# EAGLE design USB_Isolator (EAGLE 9.2.2)
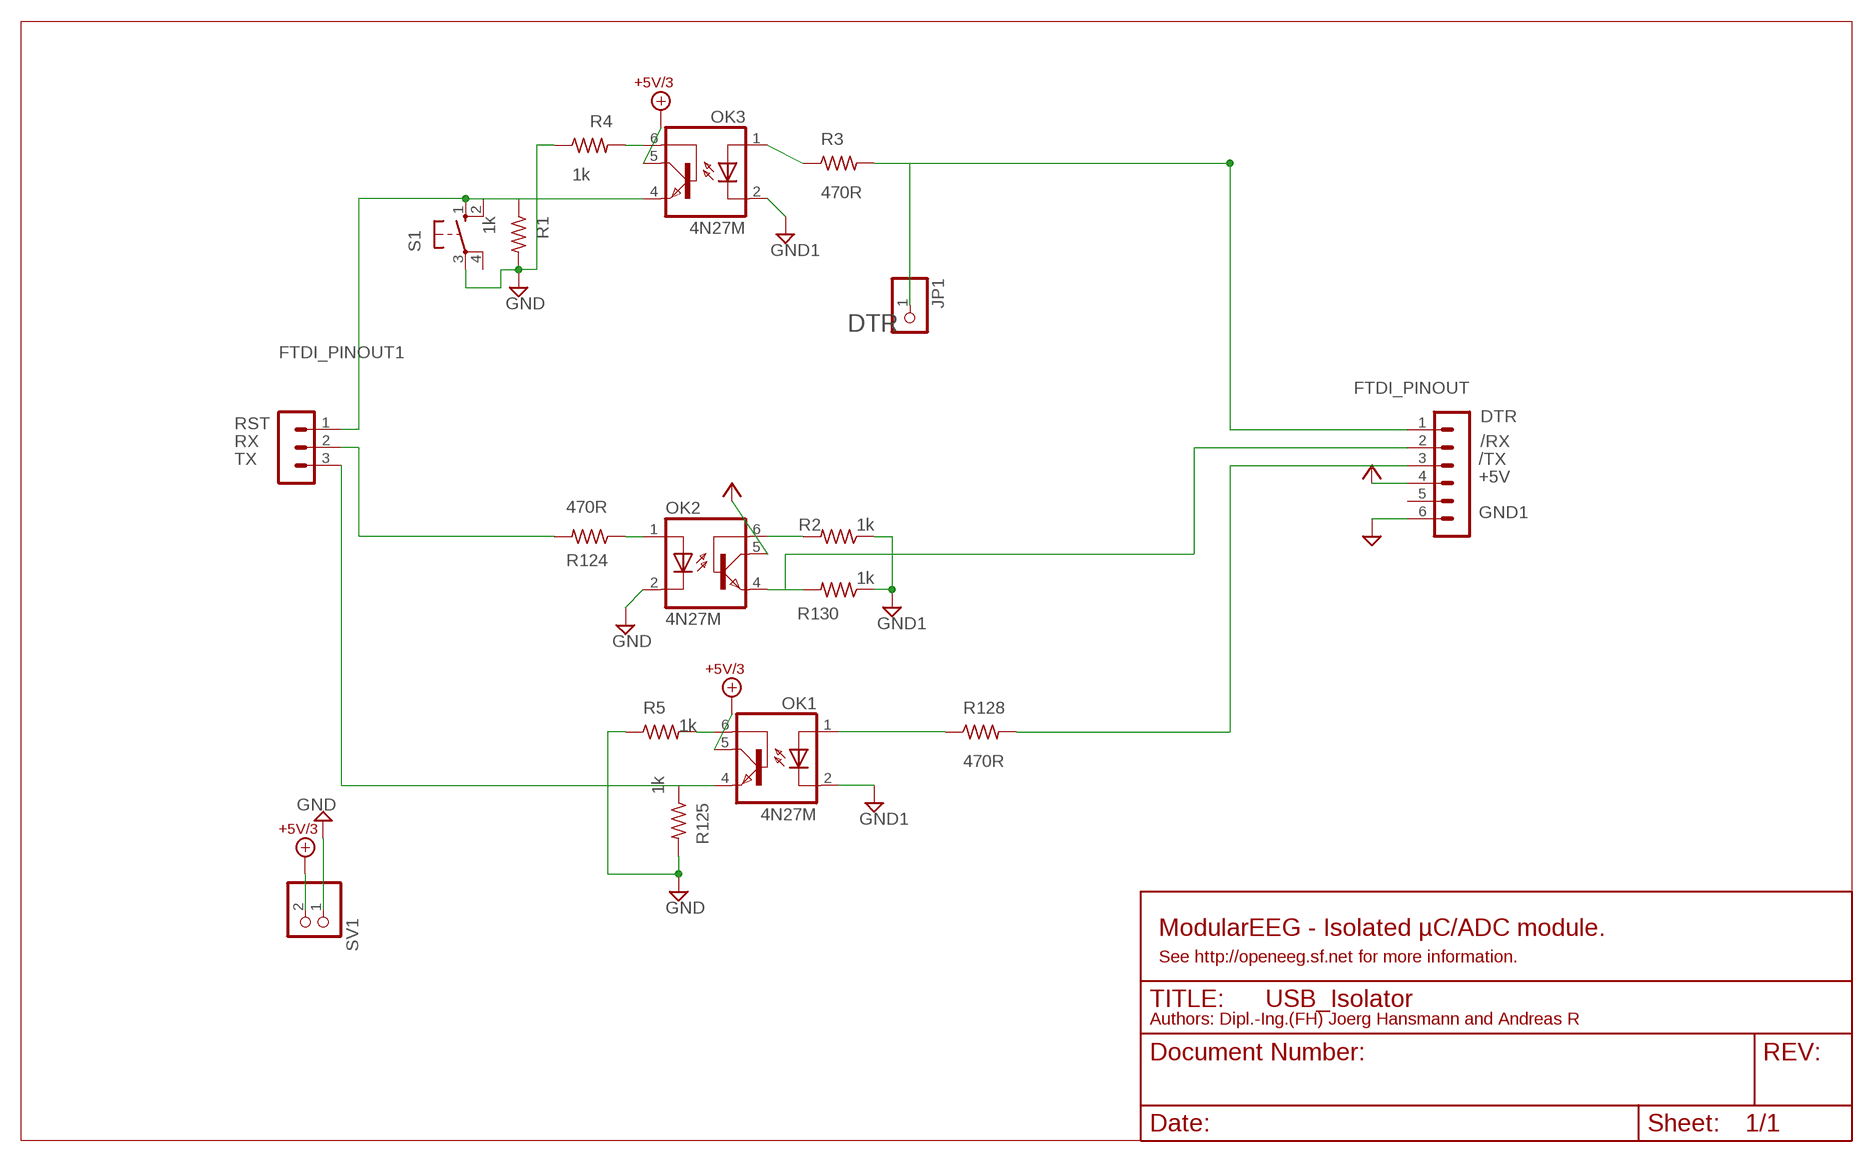
[diagram p0: schematic, sheet 1]

## Parts
FTDI_PINOUT  MA06-1  [MA06-1]
FTDI_PINOUT1  MA03-1  [MA03-1]
JP1  PINHD-1X1  [1X01]
OK1  4N27M  [DIL06]
OK2  4N27M  [DIL06]
OK3  4N27M  [DIL06]
R1  1k  R-US_0204/5  [0204/5]
R2  1k  R-US_0204/7  [0204/7]
R3  470R  R-US_0204/7  [0204/7]
R4  1k  R-US_0204/2V  [0204V]
R5  1k  R-US_0204/5  [0204/5]
R124  470R  R-US_0204/7  [0204/7]
R125  1k  R-US_0204/5  [0204/5]
R128  470R  R-US_0204/7  [0204/7]
R130  1k  R-US_0204/7  [0204/7]
S1  10-XX  [B3F-10XX]
SV1  PINHD-1X2  [1X02]

## Nets
+5V: FTDI_PINOUT.4 OK2.5(COL)
+5V/3: OK1.5(COL) OK3.5(COL) SV1.2
/RX: FTDI_PINOUT.2 OK2.4(EMI) R130.2
/TX: FTDI_PINOUT.3 R128.2
DTR: FTDI_PINOUT.1 JP1.1 R3.2
GND: OK2.2(C) R1.2 R4.1 R5.1 R125.2 S1.3(P) SV1.1
GND1: FTDI_PINOUT.6 OK1.2(C) OK3.2(C) R2.1 R130.1
N$1: OK3.1(A) R3.1
N$2: OK2.6(BAS) R2.2
N$3: OK3.6(BAS) R4.2
N$5: OK1.6(BAS) R5.2
N$8: OK2.1(A) R124.1
N$61: OK1.1(A) R128.1
RST: FTDI_PINOUT1.1 OK3.4(EMI) R1.1 S1.1(S) S1.2(S1)
RX: FTDI_PINOUT1.2 R124.2
TX: FTDI_PINOUT1.3 OK1.4(EMI) R125.1
Unconnected: FTDI_PINOUT.5 S1.4(P1)

## Notes on the sheet
- ModularEEG - Isolated µC/ADC module.
- See http://openeeg.sf.net for more information.
- Authors: Dipl.-Ing.(FH) Joerg Hansmann and Andreas R

## Library data of the parts
FTDI_PINOUT = con-lstb:MA06-1: PIN HEADER; OC_FARNELL: unknown; OC_NEWARK: unknown
FTDI_PINOUT1 = con-lstb:MA03-1: PIN HEADER; OC_FARNELL: unknown; OC_NEWARK: unknown
JP1 = pinhead:PINHD-1X1: PIN HEADER
OK1-OK3 = optocoupler:4N*?M: General Purpose 6-Pin Phototransistor Optocouplers Source: http://www.fairchildsemi.com/ds/4N/4N35-M.pdf; MF: FAIRCHILD SEMICONDUCTOR; MPN: 4N27M; OC_FARNELL: unknown; OC_NEWARK: 72K9939
R1-R5 R124 R125 R128 R130 = resistor:R-US_: RESISTOR, American symbol
S1 = switch-omron:10-XX: OMRON SWITCH; MPN: B3F-1000; OC_FARNELL: 176432; OC_NEWARK: 36M3542
SV1 = pinhead:PINHD-1X2: PIN HEADER

## Board
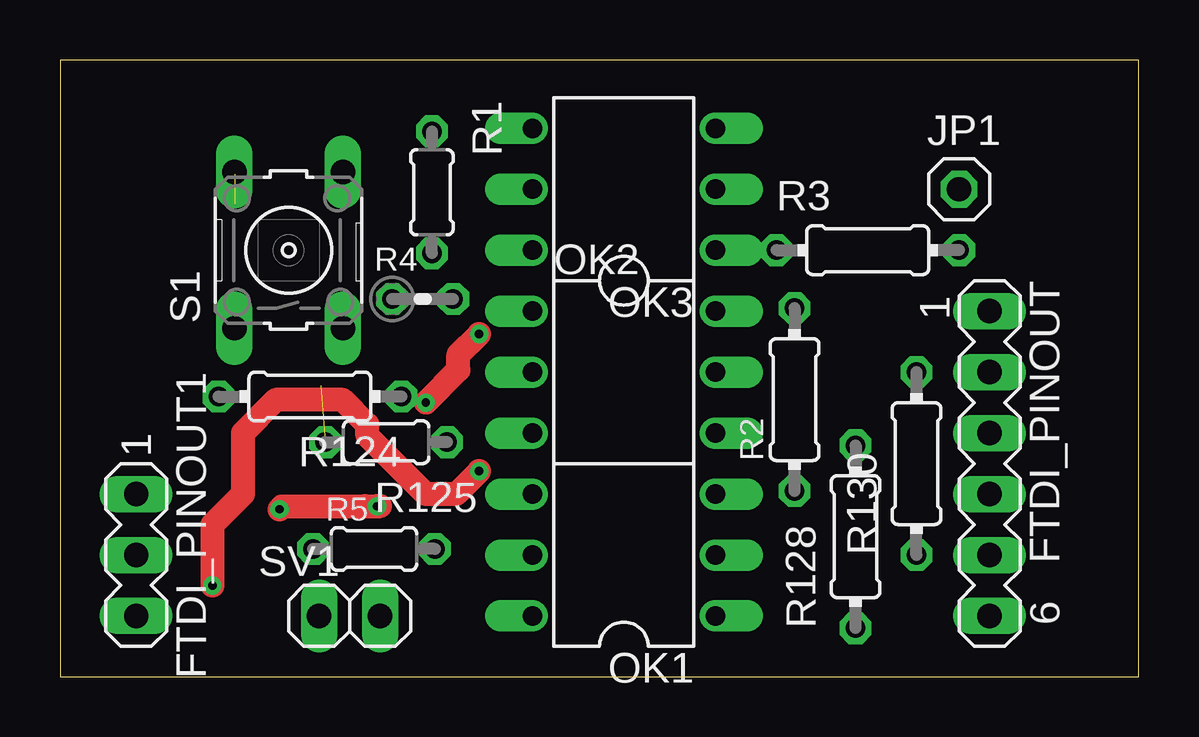
[diagram p1: board, top side]
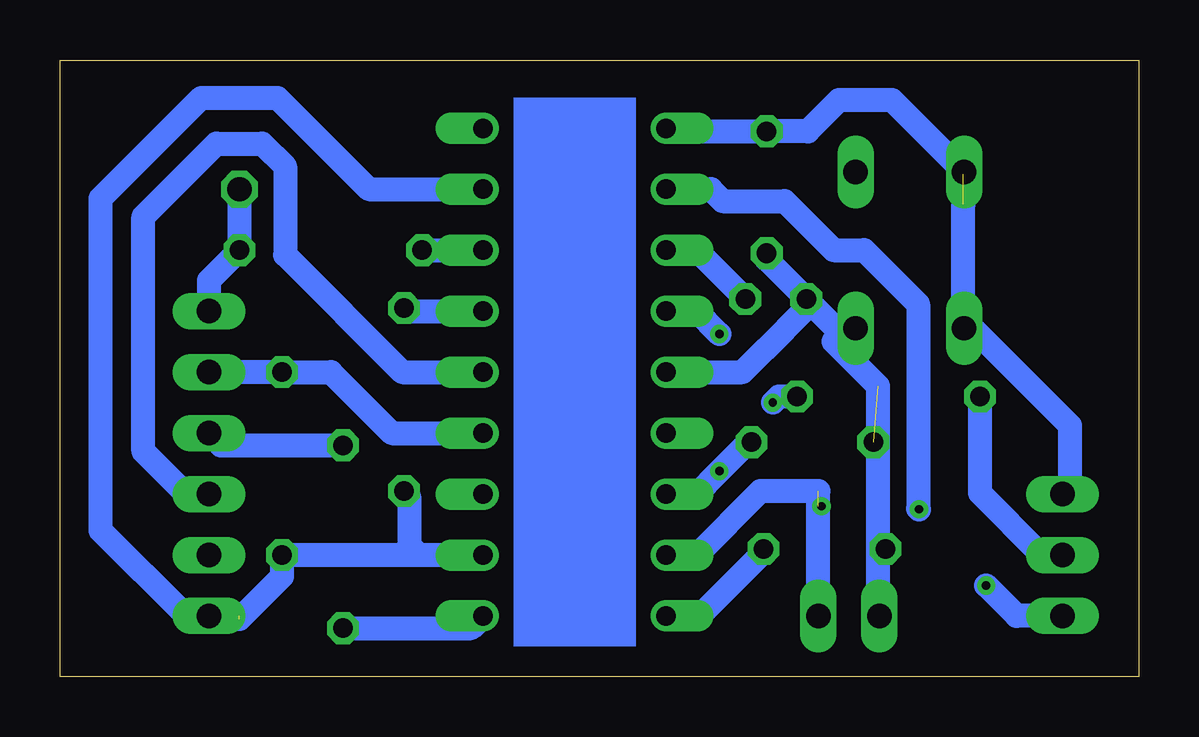
[diagram p2: board, bottom side, seen from below]

Size 44.94 x 25.7 mm. Coordinates in mm from the lower left corner, seen from the top.
Outline: 0,0 44.94,0 44.94,25.7 0,25.7 0,0
Copper layers (1*16): Top 0.035mm / dielectric 1.5mm / Bottom 0.035mm
Design rules "default *": minimum track width 1mm, minimum drill 0.35mm, track to track 0.6mm, track to pad 0.6mm, pad to pad 0.6mm, via to via 0.6mm, smd to smd 6mil, copper to edge 40mil, drill to drill 6mil, minimum pad ring 10mil, minimum via ring 8mil, stop-mask expansion 4mil, vias tented up to drill 0mil, thermal gap 10mil

### Footprints (pad centres in the part's own frame; a part is rotated, then mirrored left to right if it is on the bottom)
MA06-1 = drill 1.016 long: 1 -6.35,0; 2 -3.81,0; 3 -1.27,0; 4 1.27,0; 5 3.81,0; 6 6.35,0
MA03-1 = drill 1.016 long: 1 -2.54,0; 2 0,0; 3 2.54,0
1X01 = drill 1.016 octagon: 1 0,0
DIL06 = drill 0.813 offset: 1 -2.54,-3.81; 2 0,-3.81; 3 2.54,-3.81; 4 2.54,3.81; 5 0,3.81; 6 -2.54,3.81
0204/5 = drill 0.813 octagon: 1 -2.54,0; 2 2.54,0
0204/7 = drill 0.813 octagon: 1 -3.81,0; 2 3.81,0
0204V = drill 0.813 octagon: 1 -1.27,0; 2 1.27,0
B3F-10XX = drill 1.016 long: 1 -3.251,2.261; 2 3.251,2.261; 3 -3.251,-2.261; 4 3.251,-2.261
1X02 = drill 1.016 long: 1 -1.27,0; 2 1.27,0

### Placement (x,y rotation side)
FTDI_PINOUT  38.73,8.89 270 top
FTDI_PINOUT1  3.17,5.08 270 top
JP1  37.47,20.32 0 top
OK1  23.5,5.08 90 top
OK2  23.5,12.7 270 top
OK3  23.5,20.32 90 top
R1  15.49,20.19 270 top
R2  30.61,11.56 90 top
R3  33.66,17.78 0 top
R4  15.11,15.75 0 top
R5  13.08,5.33 0 top
R124  10.41,11.68 180 top
R125  13.59,9.78 180 top
R128  33.15,5.84 90 top
R130  35.69,8.89 90 top
S1  9.53,17.78 90 top
SV1  12.06,2.54 0 top

### Tracks (layer width: path | path; a pad name or v marks a point on that pad's centre or on a via)
+5V
  Bottom 1: OK2.5 30.67,12.7 35.56,17.59 35.56,21.27 36.51,22.23 38.42,22.23 41.47,19.18 41.47,9.4 39.69,7.62 FTDI_PINOUT.4
+5V/3  (via drill 0.35)  (1 unrouted)
  Top 1: 13.34,7.11 v13.21,7.11 12.7,7.11 12.68,7.09 9.25,7.09 v9.14,6.99
  Bottom 1: OK1.5 18.41,5.08 15.75,7.75 13.34,7.75 SV1.2 | OK3.5 17.82,20.32 17.33,19.83 14.75,19.83 12.7,17.78 11.43,17.78 9.19,15.54 9.19,7.03 v9.14,6.99
/RX
  Bottom 1: OK2.4 31.11,10.16 33.66,12.7 R130.2 FTDI_PINOUT.2
/TX
  Bottom 1: FTDI_PINOUT.3 38.23,9.65 R128.2
DTR
  Bottom 1: JP1.1 R3.2 38.73,16.51 FTDI_PINOUT.1
GND  (1 unrouted)
  Bottom 1: 10.86,5.08 10.86,12.13 11.79,13.06 | 10.86,5.08 10.86,2.6 SV1.1 | 12.7,13.97 12.43,13.97 12.58,13.85 | 12.58,13.85 11.79,13.06 | OK2.2 16.51,12.7 15.56,13.65 15.56,13.64 13.84,15.35 R4.1 | 12.58,13.85 12.58,14.48 R4.1 | R4.1 15.49,17.4 R1.2 | R5.1 10.79,5.08 10.86,5.08 | S1.3 11.79,13.06
GND1  (1 unrouted)
  Bottom 1: OK3.2 32.07,20.32 35.88,24.13 39.05,24.13 43.24,19.94 43.24,6.1 39.69,2.54 FTDI_PINOUT.6 37.47,2.54 | 37.47,2.41 35.69,4.19 R130.1 29.97,5.08 | OK1.2 29.97,5.08 | R2.1 30.39,7.53 30.39,5.49 29.97,5.08
N$1
  Bottom 1: R3.1 OK3.1
N$2
  Bottom 1: R2.2 30.48,15.24 OK2.6
N$3
  Bottom 1: R4.2 16.6,15.97 | 16.6,15.97 | 16.6,15.97 18.41,17.78 OK3.6
N$5
  Bottom 1: 19.05,2.54 OK1.6 18.29,2.54 15.62,5.21
N$8  (via drill 0.35)
  Top 1: v15.24,11.43 16.6,12.79 16.6,13.43 v17.46,14.29
  Bottom 1: R124.1 14.99,11.68 v15.24,11.43 | v17.46,14.29 18.41,15.24 OK2.1
N$61
  Bottom 1: R128.1 27.81,2.03 OK1.1
RST  (1 unrouted)
  Bottom 1: OK3.4 19.56,22.73 R1.1 13.78,22.73 12.48,24.03 10.26,24.03 S1.2 7.3,20.95 | 7.3,19.68 7.3,14.92 S1.1 6.91,14.53 2.86,10.48 2.86,7.94 2.54,7.62 FTDI_PINOUT1.1
RX
  Bottom 1: FTDI_PINOUT1.2 4.03,5.08 6.6,7.65 R124.2
TX  (via drill 0.35)
  Top 1: v17.46,8.57 16.51,7.62 15.24,7.62 12.81,10.05 12.81,10.51 11.78,11.54 9,11.54 7.62,10.16 7.62,7.62 6.35,6.35 v6.35,3.81
  Bottom 1: OK1.4 18.41,7.62 v17.46,8.57 16.26,9.78 R125.1 | FTDI_PINOUT1.3 5.08,2.54 v6.35,3.81
(copper drawn outside any net)
  shapes: Bottom area x1